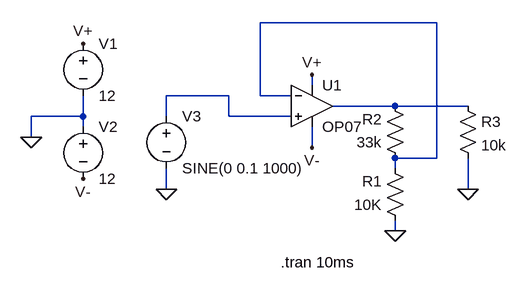
[diagram p0: schematic 002-opamp-non-invertente.asc]
002-opamp-non-invertente.asc, the LTspice schematic file:
Version 4
SHEET 1 880 680
WIRE 528 160 256 160
WIRE 336 256 336 240
WIRE 208 272 112 272
WIRE 256 272 256 160
WIRE 304 272 256 272
WIRE 464 288 368 288
WIRE 576 288 464 288
WIRE -16 304 -16 272
WIRE -16 304 -96 304
WIRE 112 304 112 272
WIRE 208 304 208 272
WIRE 304 304 208 304
WIRE -16 320 -16 304
WIRE -96 336 -96 304
WIRE 336 352 336 320
WIRE 528 368 528 160
WIRE 528 368 464 368
WIRE 464 384 464 368
WIRE 112 416 112 384
WIRE 576 416 576 368
WIRE 464 480 464 464
FLAG -96 336 0
FLAG 112 416 0
FLAG 464 480 0
FLAG 576 416 0
FLAG -16 192 V+
FLAG 336 240 V+
FLAG -16 400 V-
FLAG 336 352 V-
SYMBOL Opamps/OP07 336 224 R0
SYMATTR InstName U1
SYMBOL res 480 480 R180
WINDOW 0 36 76 Left 2
WINDOW 3 36 40 Left 2
SYMATTR InstName R1
SYMATTR Value 10K
SYMBOL res 480 384 R180
WINDOW 0 36 76 Left 2
WINDOW 3 36 40 Left 2
SYMATTR InstName R2
SYMATTR Value 33k
SYMBOL voltage -16 176 R0
SYMATTR InstName V1
SYMATTR Value 12
SYMBOL voltage -16 304 R0
SYMATTR InstName V2
SYMATTR Value 12
SYMBOL voltage 112 288 R0
SYMATTR InstName V3
SYMATTR Value SINE(0 0.1 1000)
SYMBOL res 560 272 R0
SYMATTR InstName R3
SYMATTR Value 10k
TEXT 288 528 Left 2 !.tran 10ms

The netlist it stands for:
* 002-opamp-non-invertente.asc
XU1 N002 N001 V+ V- N003 LT1001  ; OP07, pins In+ In- V+ V- OUT
R1 0 N001 10K
R2 N001 N003 33k
V1 V+ 0 12
V2 0 V- 12
V3 N002 0 SINE(0 0.1 1000)
R3 N003 0 10k
.tran 10ms
.lib LTC.lib
.backanno
.end